# EAGLE design bicicletta-power (EAGLE 6.1)
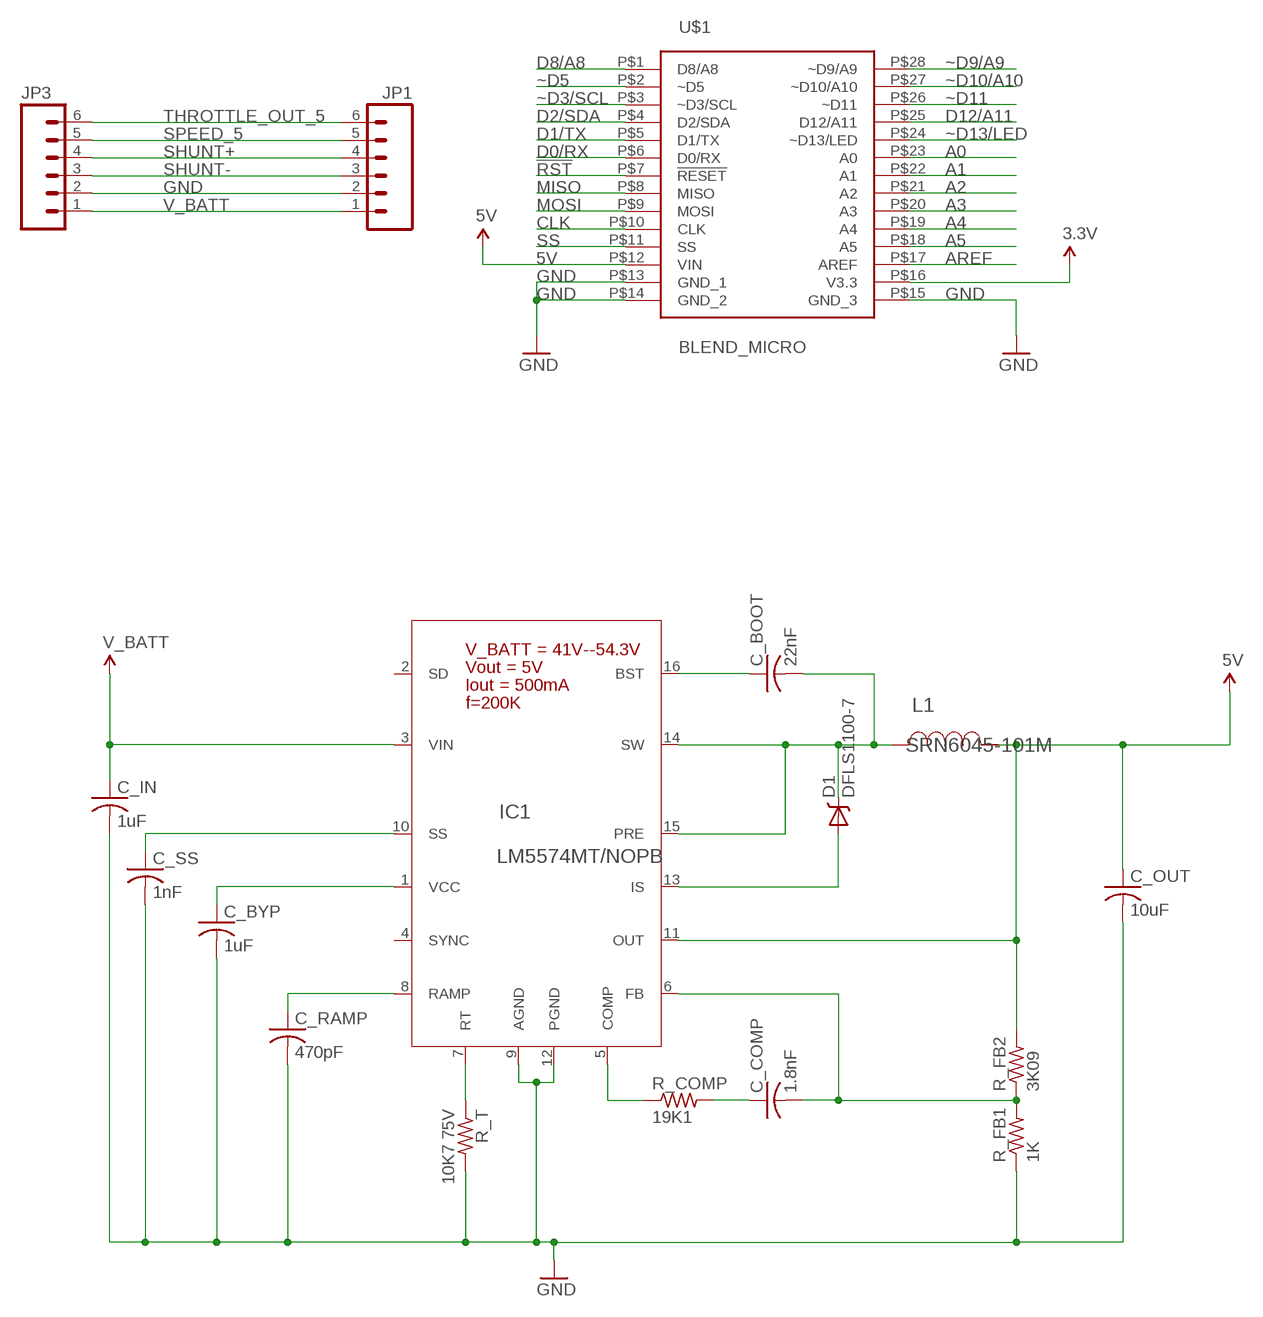
[diagram p0: schematic, sheet 1]

## Parts
C_BOOT  22nF  C-USC0603  [C0603]
C_BYP  1uF  C-USC0603  [C0603]
C_COMP  1.8nF  C-USC0603  [C0603]
C_IN  1uF  C-USC1206  [C1206]
C_OUT  10uF  C-USC0805  [C0805]
C_RAMP  470pF  C-USC0603  [C0603]
C_SS  1nF  C-USC0603  [C0603]
D1  DFLS1100-7  [POWERDI123]
IC1  LM5574MT/NOPB  [MTC16]
JP1  M06SIP  [1X06]
JP3  M06SIP  [1X06]
L1  SRN6045-101M  [SRN6045]
R_COMP  19K1  R-US_R0603  [R0603]
R_FB1  1K  R-US_R0603  [R0603]
R_FB2  3K09  R-US_R0603  [R0603]
R_T  10K7 75V  R-US_R0603  [R0603]
U$1  BLEND_MICRO  [BLEND_MICRO]

## Nets
3.3V: U$1.P$16(V3.3)
5V: C_OUT.1 IC1.11(OUT) L1.2 R_FB2.2 U$1.P$12(VIN)
!RST: U$1.P$7(!RESET)
A0: U$1.P$23(A0)
A1: U$1.P$22(A1)
A2: U$1.P$21(A2)
A3: U$1.P$20(A3)
A4: U$1.P$19(A4)
A5: U$1.P$18(A5)
AREF: U$1.P$17(AREF)
CLK: U$1.P$10(CLK)
D0/RX: U$1.P$6(D0/RX)
D1/TX: U$1.P$5(D1/TX)
D2/SDA: U$1.P$4(D2/SDA)
D8/A8: U$1.P$1(D8/A8)
D12/A11: U$1.P$25(D12/A11)
GND: C_BYP.2 C_IN.2 C_OUT.2 C_RAMP.2 C_SS.2 IC1.9(AGND) IC1.12(PGND) JP1.2 JP3.2 R_FB1.1 R_T.2 U$1.P$13(GND_1) U$1.P$14(GND_2) U$1.P$15(GND_3)
MISO: U$1.P$8(MISO)
MOSI: U$1.P$9(MOSI)
N$1: C_SS.1 IC1.10(SS)
N$2: C_BYP.1 IC1.1(VCC)
N$3: C_RAMP.1 IC1.8(RAMP)
N$5: IC1.7(RT) R_T.1
N$6: C_COMP.2 IC1.6(FB) R_FB1.2 R_FB2.1
N$7: C_COMP.1 R_COMP.2
N$8: IC1.5(COMP) R_COMP.1
N$9: D1.A IC1.13(IS)
N$10: C_BOOT.1 IC1.16(BST)
N$11: C_BOOT.2 D1.K IC1.14(SW) IC1.15(PRE) L1.1
SHUNT+: JP1.4 JP3.4
SHUNT-: JP1.3 JP3.3
SPEED_5: JP1.5 JP3.5
SS: U$1.P$11(SS)
THROTTLE_OUT_5: JP1.6 JP3.6
V_BATT: C_IN.1 IC1.3(VIN) JP1.1 JP3.1
~D3/SCL: U$1.P$3(~D3/SCL)
~D5: U$1.P$2(~D5)
~D9/A9: U$1.P$28(~D9/A9)
~D10/A10: U$1.P$27(~D10/A10)
~D11: U$1.P$26(~D11)
~D13/LED: U$1.P$24(~D13/LED)
Unconnected: IC1.2(SD) IC1.4(SYNC)

## Notes on the sheet
- V_BATT = 41V--54.3V
- Vout = 5V
- Iout = 500mA
- f=200K

## Library data of the parts
C_BOOT C_BYP C_COMP C_IN C_OUT C_RAMP C_SS = rcl:C-US: CAPACITOR, American symbol
D1 = TI:DFLS1100-7; DATASHEETURL: http://www.diodes.com/datasheets/ds30497.pdf; IO: 1.0; MANUFACTURER_NAME: Diodes Inc.; MANUFACTURER_PART_NUMBER: DFLS1100-7; VENDOR: Diodes Inc.; VFATIO: 0.77; VRRM: 100.0
IC1 = TI:LM5574MT/NOPB; DATASHEETURL: http://www.ti.com/product/lm5574; FREQUENCY: 500000.0; IMAX: 0.5; MANUFACTURER_NAME: Texas Instruments; MANUFACTURER_PART_NUMBER: LM5574MT/NOPB; MKTG_PACKAGE: NA; NSID: LM5574MT/NOPB; PACKAGE: NA; VENDOR: Texas Instruments
JP1 JP3 = SparkFun-Connectors:M06: Header 6 Standard 6-pin 0.1" header. Use with straight break away headers (SKU : PRT-00116), right angle break away headers (PRT-00553), swiss pins (PRT-00743), machine pins (PRT-00117), and female headers (PRT-00115). Molex polarized connector foot print use with SKU : PRT-08094 with associated crimp pins and housings. NOTES ON THE VARIANTS LOCK and LOCK_LONGPADS... This footprint was designed to help hold the alignment of a through-hole component (i.e. 6-pin header) while soldering it into place. You may notice that each hole has been shifted either up or down by 0.005 of an inch from it's more standard position (which is a perfectly straight line). This slight alteration caused the pins (the squares in the middle) to touch the edges of the holes. Because they are alternating, it causes a "brace" to hold the component in place. 0.005 has proven to be the perfect amount of "off-center" position when using our standard breakaway headers. Although looks a little odd when you look at the bare footprint, once you have a header in there, the alteration is very hard to notice. Also, if you push a header all the way into place, it is covered up entirely on the bottom side. This idea of altering the position of holes to aid alignment will be further integrated into the Sparkfun Library for other footprints. It can help hold any component with 3 or more connection pins.
L1 = TI:SRN6045-101M; DATASHEETURL: http://www.bourns.com/data/global/pdfs/SRN6045.pdf; DCR: 0.494; IDC: 0.7; L: 1.0E-4; MANUFACTURER_NAME: Bourns; MANUFACTURER_PART_NUMBER: SRN6045-101M; VENDOR: Bourns
R_COMP R_FB1 R_FB2 R_T = rcl:R-US_: RESISTOR, American symbol
U$1 = Railstars:BLEND_MICRO

## Board
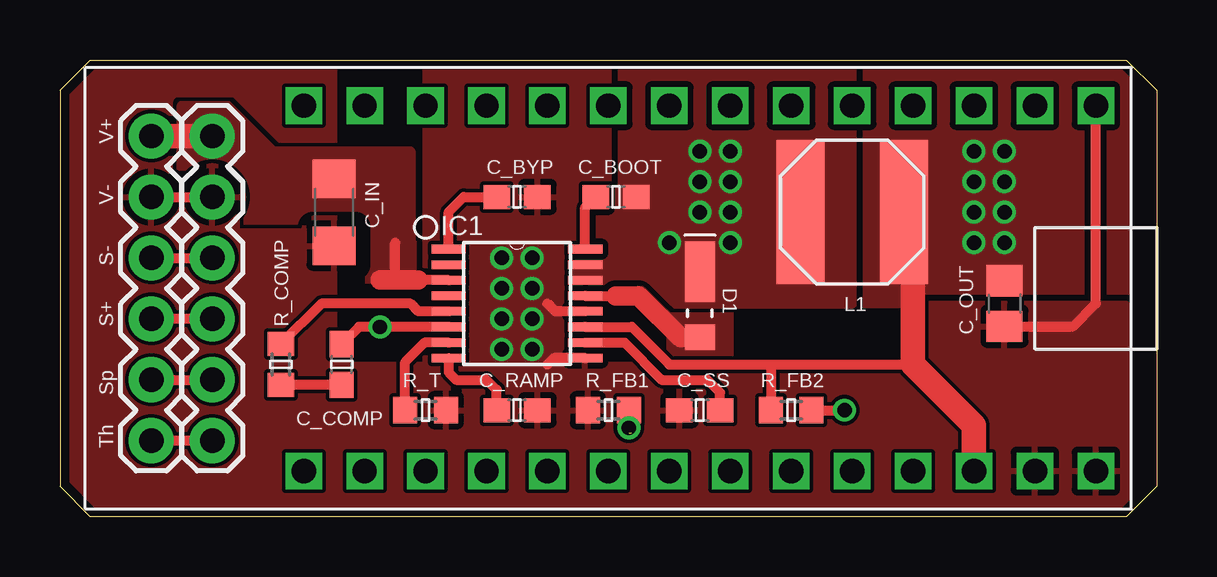
[diagram p1: board, top side]
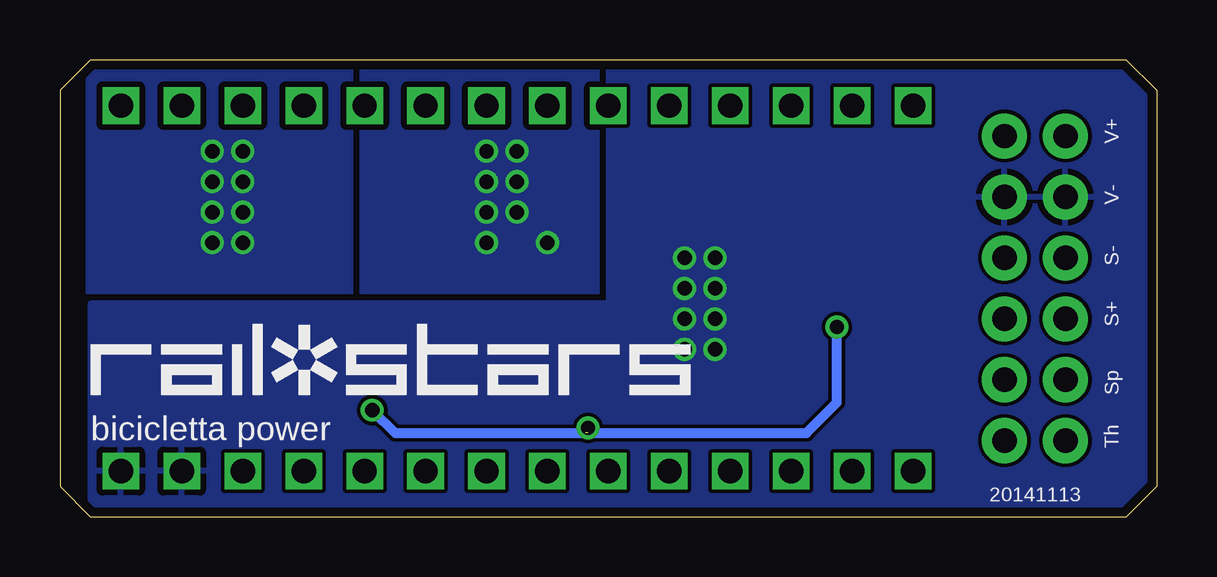
[diagram p2: board, bottom side, seen from below]

Size 45.72 x 19.05 mm. Coordinates in mm from the lower left corner, seen from the top.
Outline: 0,17.78 1.27,19.05 44.45,19.05 45.72,17.78 45.72,1.27 44.45,0 1.27,0 0,1.27 0,17.78
Copper layers (1*16): Top 0.0356mm / dielectric 1.5011mm / Bottom 0.0356mm
Design rules: minimum track width 6mil, minimum drill 13mil, track to track 6mil, track to pad 6mil, pad to pad 6mil, via to via 6mil, smd to smd 6mil, copper to edge 15mil, drill to drill 6mil, minimum pad ring 7mil, minimum via ring 7mil, stop-mask expansion 0mil, vias tented up to drill 200mil, thermal gap 10mil

### Footprints (pad centres in the part's own frame; a part is rotated, then mirrored left to right if it is on the bottom)
C0603 = smd 1.1 x 1: 1 -0.85,0; 2 0.85,0
C1206 = smd 1.6 x 1.8: 1 -1.4,0; 2 1.4,0
C0805 = smd 1.3 x 1.5: 1 -0.95,0; 2 0.95,0
POWERDI123 = smd 1.067 x 1.245: A 1.727,0 | smd 2.515 x 1.245: K -1.003,0
MTC16 = smd 1.422 x 0.356: 1 -2.845,2.275; 2 -2.845,1.625; 3 -2.845,0.975; 4 -2.845,0.325; 5 -2.845,-0.325; 6 -2.845,-0.975; 7 -2.845,-1.625; 8 -2.845,-2.275; 9 2.845,-2.275; 10 2.845,-1.625; 11 2.845,-0.975; 12 2.845,-0.325; 13 2.845,0.325; 14 2.845,0.975; 15 2.845,1.625; 16 2.845,2.275
1X06 = drill 1.016 pad 1.88: 1 0,0; 2 2.54,0; 3 5.08,0; 4 7.62,0; 5 10.16,0; 6 12.7,0
SRN6045 = smd 2.007 x 5.994: 1 -2.15,0; 2 2.15,0
R0603 = smd 1 x 1.1: 1 -0.85,0; 2 0.85,0
BLEND_MICRO = drill 1.016 square: P$1 -7.62,12.7; P$2 -7.62,10.16; P$3 -7.62,7.62; P$4 -7.62,5.08; P$5 -7.62,2.54; P$6 -7.62,0; P$7 -7.62,-2.54; P$8 -7.62,-5.08; P$9 -7.62,-7.62; P$10 -7.62,-10.16; P$11 -7.62,-12.7; P$12 -7.62,-15.24; P$13 -7.62,-17.78; P$14 -7.62,-20.32; P$15 7.62,-20.32; P$16 7.62,-17.78; P$17 7.62,-15.24; P$18 7.62,-12.7; P$19 7.62,-10.16; P$20 7.62,-7.62; P$21 7.62,-5.08; P$22 7.62,-2.54; P$23 7.62,0; P$24 7.62,2.54; P$25 7.62,5.08; P$26 7.62,7.62; P$27 7.62,10.16; P$28 7.62,12.7

### Placement (x,y rotation side)
C_BOOT  23.18,13.34 0 top
C_BYP  19.05,13.34 0 top
C_COMP  11.75,6.35 90 top
C_IN  11.43,12.7 270 top
C_OUT  39.37,8.89 270 top
C_RAMP  19.05,4.45 0 top
C_SS  26.67,4.45 180 top
D1  26.67,9.21 270 top
IC1  19.05,8.89 0 top
JP1  6.35,15.88 270 top
JP3  3.81,15.88 270 top
L1  33.02,12.7 0 top
R_COMP  9.21,6.35 270 top
R_FB1  22.86,4.45 0 top
R_FB2  30.48,4.45 180 top
R_T  15.24,4.45 0 top
U$1  22.86,9.53 90 top
U$2  [RAILSTARS_25MM]  44.45,5.08 0 bottom

### Tracks (layer width: path | path; a pad name or v marks a point on that pad's centre or on a via)
5V  (via drill 0.6)
  Top 0.406: IC1.11 23.84,7.92 25.4,6.35 29.63,6.35 | 29.63,6.35 R_FB2.2 | 29.63,6.35 35.56,6.35
  Top 1.016: U$1.P$12 38.1,3.81 35.56,6.35 35.56,10.16
  other vias: 38.1,13.97 38.1,12.7 38.1,11.43 39.37,11.43 39.37,12.7 39.37,13.97 39.37,15.24 38.1,15.24
  pour Top (isolate 0.254, rank 4, no thermals): 33.02,19.05 44.45,19.05 44.45,8.89 33.02,8.89
  pour Bottom (isolate 0.254, rank 4, no thermals): 33.02,19.05 44.45,19.05 44.45,8.89 33.02,8.89
GND  (via drill 0.6)
  Top 0.406: JP3.2 JP1.2 | IC1.12 20.64,8.56 20.32,8.89 | IC1.9 20.59,6.62 20.32,6.35 | C_OUT.2 42.23,7.94 43.18,8.89 U$1.P$15
  other vias: 18.41,9.53 19.68,9.53 19.68,8.26 18.41,8.26 18.41,6.99 19.68,6.99 19.68,10.79 18.41,10.79
  pour Top (rank 2): 15.24,19.05 22.86,19.05 22.86,11.43 20.95,11.43 20.95,6.35 27.94,6.35 27.94,8.89 44.45,8.89 44.45,0 0,0 0,19.05 11.43,19.05 11.43,6.35 15.24,6.35
  pour Bottom (rank 2): 0,19.05 22.86,19.05 22.86,8.89 44.45,8.89 44.45,0 0,0
N$1
  Top 0.406: IC1.10 23.53,7.26 25.08,5.71 26.99,5.71 27.52,5.18 C_SS.1
N$2
  Top 0.406: IC1.1 16.2,12.71 16.83,13.34 C_BYP.1
N$3
  Top 0.406: IC1.8 16.2,6.02 16.51,5.71 17.78,5.71 18.2,5.29 C_RAMP.1
N$5
  Top 0.406: IC1.7 15.2,7.26 14.39,6.45 R_T.1
N$6  (via drill 0.6)  (1 unrouted)
  Top 0.406: IC1.6 v13.34,7.92 12.46,7.92 C_COMP.2 | R_FB2.1 v32.7,4.45 | R_FB1.2 v23.71,3.71
  Bottom 0.406: v13.34,7.92 13.34,4.76 14.61,3.49 23.71,3.49 v23.71,3.71 | v32.7,4.45 31.75,3.49 23.81,3.49
N$7
  Top 0.406: C_COMP.1 R_COMP.2
N$8
  Top 0.406: IC1.5 14.93,8.56 14.61,8.89 10.9,8.89 R_COMP.1
N$9
  Top 0.406: IC1.13 23.17,9.21
  Top 0.813: 23.17,9.21 24.12,9.21 25.86,7.48 D1.A
  pour Top (rank 4, no thermals): 27.94,8.89 27.94,6.35 25.4,6.35 25.4,7.62 24.13,8.89 24.13,9.53 25.08,9.53 25.72,8.89
N$10
  Top 0.406: IC1.16 21.89,12.9 C_BOOT.1
N$11  (via drill 0.6)
  other vias: 27.94,15.24 27.94,13.97 27.94,12.7 26.67,12.7 26.67,13.97 26.67,15.24 27.94,11.43 25.4,11.43
  pour Top (isolate 0.254, rank 3, no thermals): 33.02,19.05 19.05,19.05 19.05,8.89 33.02,8.89
  pour Bottom (isolate 0.254, rank 3, no thermals): 33.02,19.05 19.05,19.05 19.05,8.89 33.02,8.89
SHUNT+
  Top 0.406: JP1.4 JP3.4
SHUNT-
  Top 0.406: JP3.3 JP1.3
SPEED_5
  Top 0.406: JP3.5 JP1.5
THROTTLE_OUT_5
  Top 0.406: JP1.6 JP3.6
V_BATT
  Top 0.406: IC1.3 14.92,9.87 | 13.97,9.87 13.97,11.43
  Top 0.813: 14.92,9.87 13.97,9.87 13.34,9.87
  Top 1.016: JP3.1 JP1.1
  pour Top (isolate 0.61, no thermals): 5.08,17.14 6.99,17.14 8.89,15.24 14.61,15.24 14.61,11.43 16.51,10.16 16.51,9.53 13.02,9.53 12.38,10.48 12.38,12.38 5.08,12.38

### Text on the board
tPlace: V+ | V- | S- | S+ | Sp | Th
bPlace: V+ | V- | S- | S+ | Sp | Th | bicicletta power | 20141113